# EasyEDA Pro project tumki_bot1_vib_sens_driv.eprj

# Schematic Schematic1
Board Name: Board1; Create Date: 2025-09-21; Page Name: P1; Project Name: tumki_bot1_vib_sens_driv; Schematic Name: Schematic1; Update Date: 2025-09-21; Company: EasyEDA.com; Page Size: A4; Version: V1.0
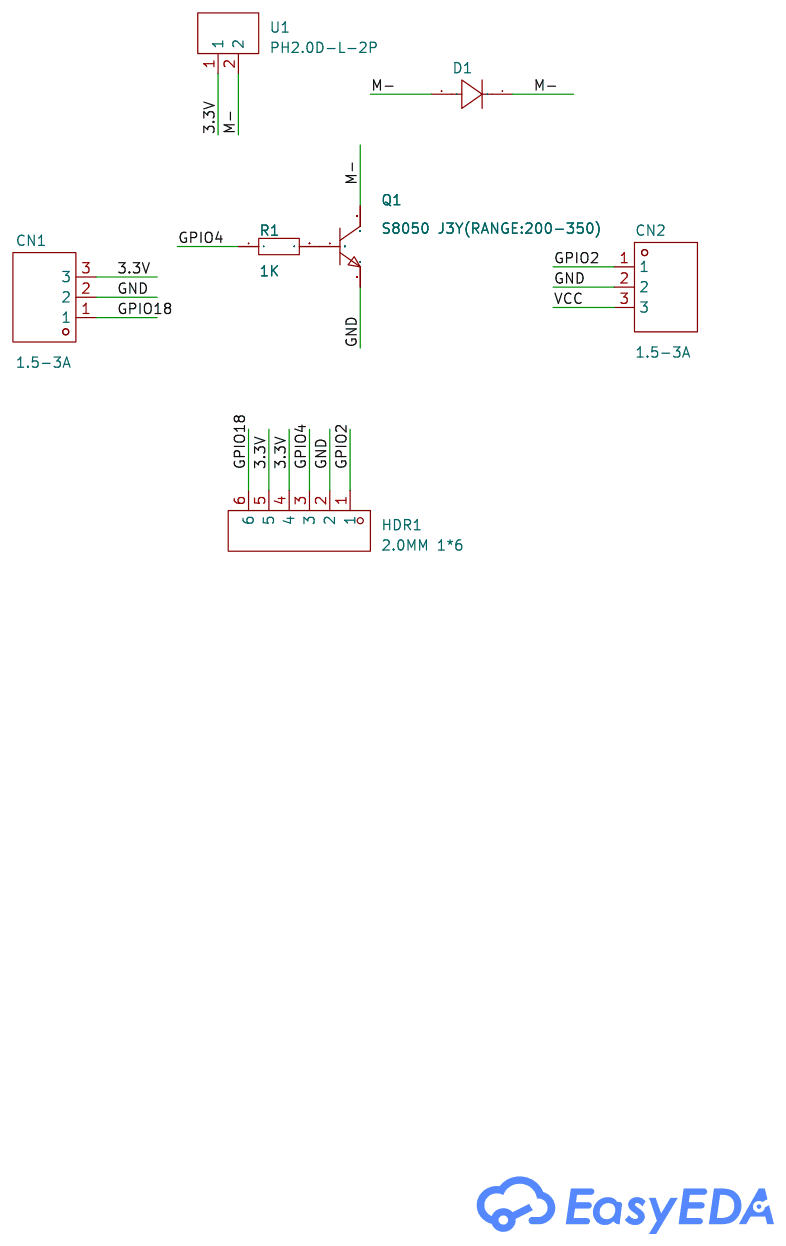
[diagram p0: schematic sheet]

## Parts
CN1  1.5-3A  [CONN-TH_3P-P1.50_ZH-3A]
CN2  1.5-3A  [CONN-TH_3P-P1.50_ZH-3A]
D1  -  [SMA_L4.4-W2.8-LS5.4-RD]
HDR1  2.0MM 1*6  [HDR-TH_6P-P2.00-V-F]
Q1  S8050 J3Y(RANGE:200-350)  [SOT-23-3_L3.0-W1.7-P0.95-LS2.9-BR]
R1  10K  [R0603]
U1  PH2.0D-L-2P  [CONN-TH_PH-2A_C2908623]

## Library data of the parts
CN1 CN2 = 1.5-3A: Supplier Part: C49404; Supplier Footprint: 1x3mm-1.5mm; JLCPCB Part Class: Extended Part; Supplier: LCSC
D1 = 1N4007: Supplier Footprint: SMA(DO-214AC); Supplier Part: C727081
HDR1 = 2.0MM 1*6: Supplier Part: C9900026821; Supplier Footprint: 排母1*6P; JLCPCB Part Class: Extended Part; Supplier: LCSC
Q1 = S8050 J3Y(RANGE:200-350): LCSC Part Name: H档(200-350) NPN 电流:0.5A 电压:25V; Supplier Part: C2146; Manufacturer: CJ(江苏长电/长晶); Supplier Footprint: SOT-23; JLCPCB Part Class: Basic Part; Datasheet: https://item.szlcsc.com/datasheet/S8050%2520J3Y(RANGE%253A200-350)/2503.html; Supplier: LCSC; type: NPN; Current - Collector(Ic): 500mA; Collector - Emitter Voltage VCEO: 25V; Pd - Power Dissipation: 300mW; DC Current Gain: 200@500mA,1V; Transition frequency(fT): 150MHz; Current - Collector Cutoff: 100nA; Vce Saturation(VCE(sat)): 600mV@500mA,50mA; Operating Temperature: -55℃~+150℃; Emitter-Base Voltage(Vebo): 5V; Number: 1 NPN
R1 = Res_0603: Supplier Footprint: 0603
U1 = PH2.0D-L-2P: Supplier Part: C2935791; Supplier Footprint: HDR-1X2; JLCPCB Part Class: Extended Part; Supplier: LCSC

## Nets
3.3V: CN1.3 HDR1.4 HDR1.5 U1.1
GND: CN1.2 CN2.2 HDR1.2 Q1.2(E)
VCC: CN2.3
GPIO2: CN2.1 HDR1.1
GPIO4: HDR1.3 R1.1
GPIO18: CN1.1 HDR1.6
M-: D1.1(K) D1.2(A) Q1.3(C) U1.2
$1N596: Q1.1(B) R1.2

# Board PCB1
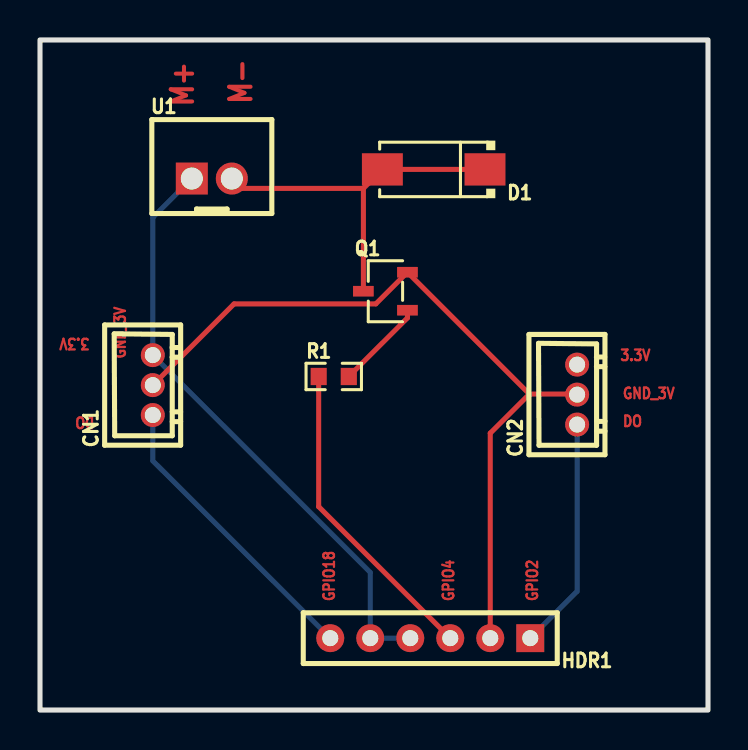
[diagram p1: board, top side]
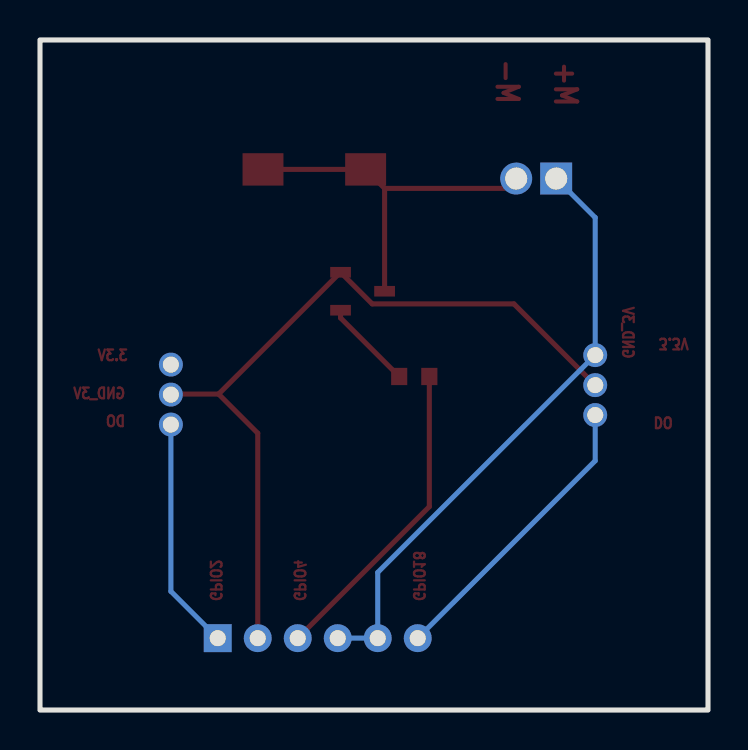
[diagram p2: board, bottom side, seen from below]

Outline 33.4 x 33.53 mm; copper layers: Top Layer, Bottom Layer. Coordinates in mm from the lower left corner of the outline.
Outline path: rectangle 0,33.53 33.4,0
Stack: Top Layer 0.035mm / Dielectric1 1.51mm FR4 er 4.5 / Bottom Layer 0.035mm

## Design rules (mm)
template: JLCPCB Capability(Two Layers Board)
spacing copperThickness1oz (default): track to track 0.102, other pairs 0.152 to 0.3
spacing copperThickness2oz: track to track 0.203, other pairs 0.152 to 0.3
track width copperThickness1oz (default): min 0.127, default 0.254, max 2.54
track width copperThickness2oz: min 0.203, default 0.254, max 2.54
differential pair differentialPair (default): width min 0.127, default 0.254, max 2.54; gap min 0.152, default 0.152
via viaSize (default): diameter min 0.5, default 0.61, max 10; hole min 0.3, default 0.305, max 6.3

## Placement (name value [footprint] x y rotation side)
CN1  1.5-3A  [CONN-TH_3P-P1.50_ZH-3A]  5.64 16.26 90 top
CN2  1.5-3A  [CONN-TH_3P-P1.50_ZH-3A]  26.86 15.78 90 top
D1  -  [SMA_L4.4-W2.8-LS5.4-RD]  19.69 27.05 180 top
HDR1  2.0MM 1*6  [HDR-TH_6P-P2.00-V-F]  19.51 3.6 180 top
Q1  S8050 J3Y(RANGE:200-350)  [SOT-23-3_L3.0-W1.7-P0.95-LS2.9-BR]  17.27 20.96 0 top
R1  10K  [R0603]  14.69 16.69 0 top
U1  PH2.0D-L-2P  [CONN-TH_PH-2A_C2908623]  8.59 26.59 0 top

## Footprints (pads in the part's own frame, mm; a bottom-side part is the same pattern mirrored in y, then rotated)
CONN-TH_3P-P1.50_ZH-3A
  round 1.2 hole 0.8: 1(-1.5,0) 2(-0.002,0) 3(1.5,0)
CONN-TH_PH-2A_C2908623
  rect 1.6x1.6 hole 1.1: 1(-1,0)
  round 1.6 hole 1.1: 2(1,0)
HDR-TH_6P-P2.00-V-F
  rect 1.4x1.4 hole 0.8: 1(-5,0)
  round 1.4 hole 0.8: 2(-3,0) 3(-1,0) 4(1,0) 5(3,0) 6(5,0)
R0603
  rect 0.806x0.864 smd: 1(-0.753,0) 2(0.753,0)
SMA_L4.4-W2.8-LS5.4-RD
  rect 2.046x1.62 smd: 1(-2.566,0) 2(2.566,0)
SOT-23-3_L3.0-W1.7-P0.95-LS2.9-BR
  rect 1.038x0.532 smd: 1(1.101,-0.95) 2(1.101,0.95) 3(-1.101,0)

## Nets
As in the schematic.

## Routing (per net, layer and track width the routed paths; a pad name or vN(x,y) marks a point on that pad's centre or on a via; arc(x,y) is an arc through that point)
3.3V: length 30.3
  Bottom Layer w0.254: U1.1 5.64,24.64 CN1.3 16.51,6.89 HDR1.5 HDR1.4
GND: length 39.1
  Top Layer w0.254: HDR1.2 22.51,13.85 24.47,15.81 ; 24.47,15.81 26.83,15.81 CN2.2 ; 24.47,15.81 Q1.2 16.79,20.32 9.7,20.32 CN1.2
GPIO2: length 11.7
  Bottom Layer w0.254: CN2.1 26.86,5.94 HDR1.1
GPIO4: length 15.8
  Top Layer w0.254: R1.1 13.93,10.18 HDR1.3
GPIO18: length 14.8
  Bottom Layer w0.254: HDR1.6 5.64,12.47 CN1.1
M-: length 18.4
  Top Layer w0.254: 16.17,26.1 D1.2 D1.1 ; 16.17,26.1 10.08,26.1 U1.2 ; 16.17,26.1 Q1.3
$1N596: length 4.5
  Top Layer w0.254: R1.2 18.37,19.62 Q1.1

## Text on the board
Top Layer: GND_3V | DO | GPIO18 | GPIO4 | GPIO2 | 3.3V | M+ | M-
